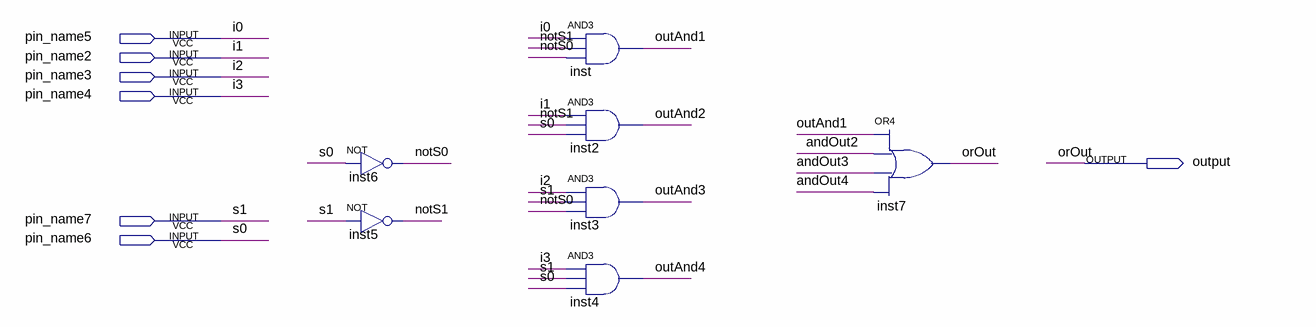
[diagram p0: schematic sheet]
// Quartus schematic multiplexer.bdf as structural Verilog: 7 symbols, 7 pins
module multiplexer (
  input  pin_name5,
  input  pin_name2,
  input  pin_name3,
  input  pin_name4,
  input  pin_name7,
  input  pin_name6,
  output \output 
);

  wire andOut2, andOut3, andOut4, notS0, notS1, outAnd1, outAnd2, outAnd3, outAnd4;

  not inst6 (notS0, pin_name6);
  not inst5 (notS1, pin_name7);
  and inst (outAnd1, pin_name5, notS1, notS0);
  and inst2 (outAnd2, pin_name2, notS1, pin_name6);
  and inst3 (outAnd3, pin_name3, pin_name7, notS0);
  and inst4 (outAnd4, pin_name4, pin_name7, pin_name6);
  or inst7 (\output , outAnd1, andOut2, andOut3, andOut4);

  // Other names for the same wires on the sheet: i0 = pin_name5; i1 = pin_name2; i2 = pin_name3; i3 = pin_name4;
  //   orOut = \output ; s0 = pin_name6; s1 = pin_name7
endmodule
